# EAGLE design with 168 (EAGLE 5.07)
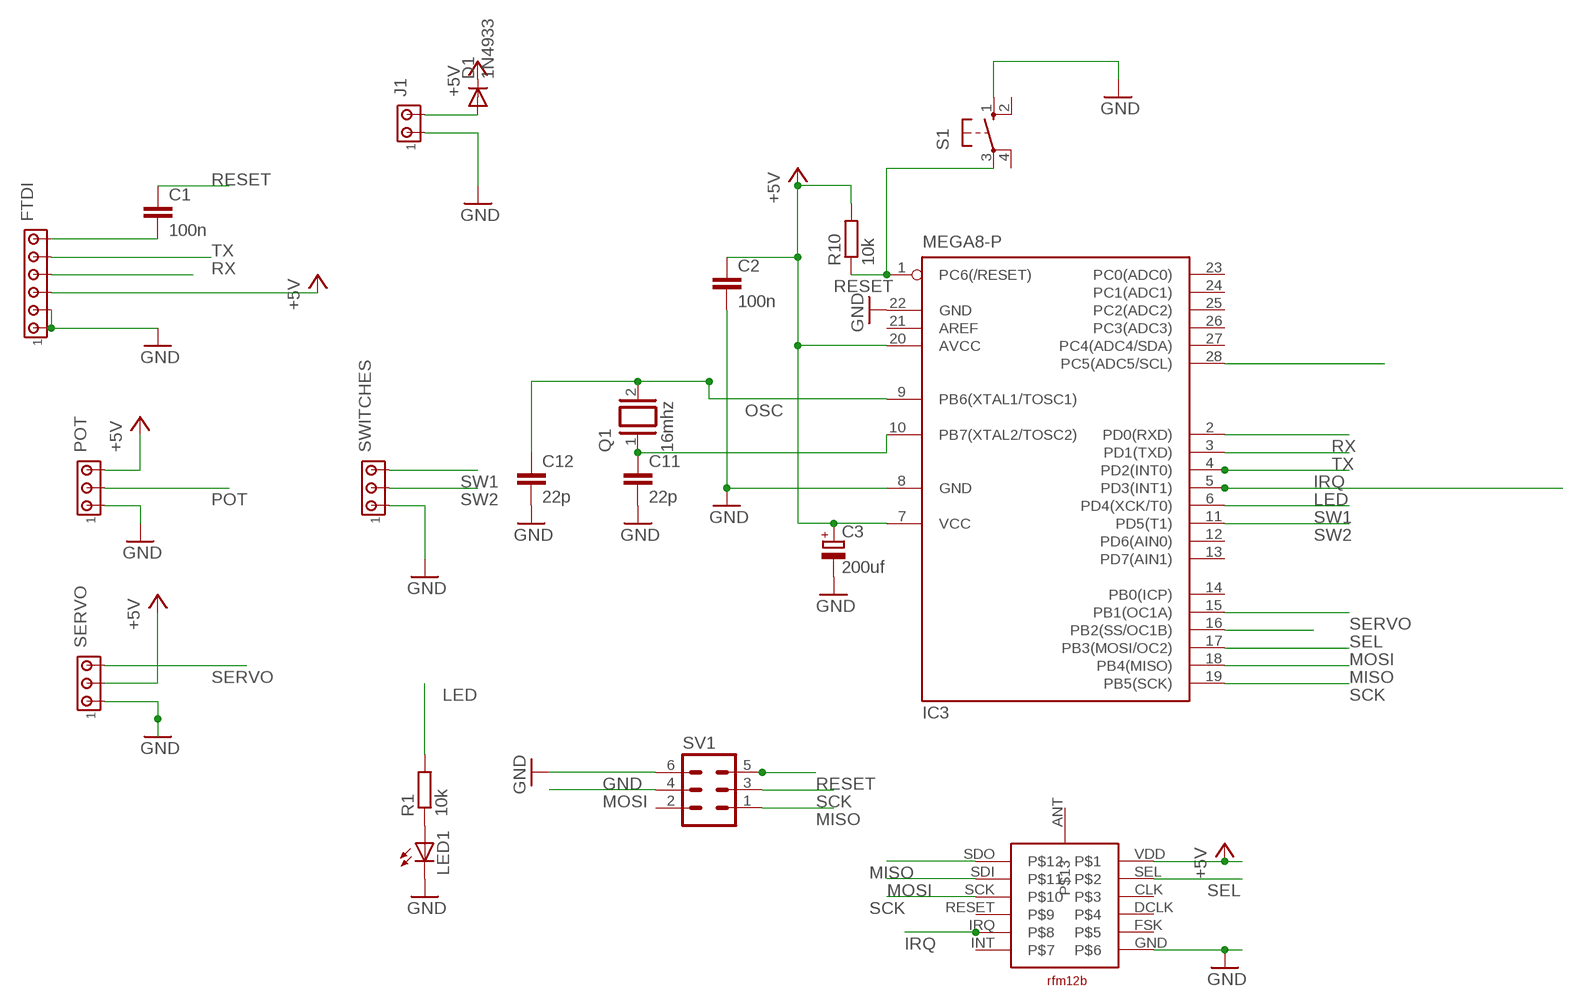
[diagram p0: schematic, sheet 1]

## Parts
C1  100n  C-EU050-025X075  [C050-025X075]
C2  100n  C-EU050-025X075  [C050-025X075]
C3  200uf  CPOL-EUE2-4  [E2-4]
C11  22p  C-EU050-025X075  [C050-025X075]
C12  22p  C-EU050-025X075  [C050-025X075]
D1  1N4933  [DO41-10]
FTDI  MTA06-100  [10X06MTA]
IC3  MEGA8-P  [DIL28-3]
J1  MTA02-100  [10X02MTA]
LED1  LED5MM  [LED5MM]
POT  MTA03-100  [10X03MTA]
Q1  16mhz  XTAL/S  [QS]
R1  10k  R-EU_0204/7  [0204/7]
R10  10k  R-EU_0204/7  [0204/7]
S1  10-XX  [B3F-10XX]
SERVO  MTA03-100  [10X03MTA]
SV1  MA03-2  [MA03-2]
SWITCHES  MTA03-100  [10X03MTA]
U$1  RFM12B  [HOPERFM12B]

## Nets
+5V: C2.1 C3.+ D1.C FTDI.4 IC3.7(VCC) IC3.20(AVCC) POT.3 R10.2 SERVO.2 U$1.VDD
GND [power]: C2.2 C3.- C11.2 C12.2 FTDI.5 FTDI.6 IC3.8(GND) IC3.22(GND) J1.1 LED1.K(C) POT.1 S1.1(S) SERVO.1 SV1.6 SWITCHES.1 U$1.GND
IRQ: IC3.4(PD2(INT0)) U$1.IRQ
LED: IC3.5(PD3(INT1)) R1.2
MISO: IC3.18(PB4(MISO)) SV1.1 U$1.SDO
MOSI: IC3.17(PB3(MOSI/OC2)) SV1.4 U$1.SDI
N$1: LED1.A R1.1
N$4: D1.A J1.2
N$5: C1.2 FTDI.1
N$10: C11.1 IC3.10(PB7(XTAL2/TOSC2)) Q1.1
OSC: C12.1 IC3.9(PB6(XTAL1/TOSC1)) Q1.2
POT: IC3.28(PC5(ADC5/SCL)) POT.2
RESET: C1.1 IC3.1(PC6(/RESET)) R10.1 S1.3(P) SV1.5
RX: FTDI.3 IC3.2(PD0(RXD))
SCK: IC3.19(PB5(SCK)) SV1.3 U$1.SCK
SEL: IC3.16(PB2(SS/OC1B)) U$1.SEL
SERVO: IC3.15(PB1(OC1A)) SERVO.3
SW1: IC3.6(PD4(XCK/T0)) SWITCHES.3
SW2: IC3.11(PD5(T1)) SWITCHES.2
TX: FTDI.2 IC3.3(PD1(TXD))
Unconnected: IC3.12(PD6(AIN0)) IC3.13(PD7(AIN1)) IC3.14(PB0(ICP)) IC3.21(AREF) IC3.23(PC0(ADC0)) IC3.24(PC1(ADC1)) IC3.25(PC2(ADC2)) IC3.26(PC3(ADC3)) IC3.27(PC4(ADC4/SDA)) S1.2(S1) S1.4(P1) SV1.2 U$1.ANT U$1.CLK U$1.DCLK U$1.FSK U$1.INT U$1.RESET

## Library data of the parts
C1 C2 C11 C12 = matt rcl:C-EU: CAPACITOR, European symbol
C3 = matt rcl:CPOL-EU: POLARIZED CAPACITOR, European symbol
D1 = matt diode:1N4933: DIODE fast recovery rectifier, 1A
FTDI = matt con-amp:MTA06-100: AMP connector
IC3 = atmel:MEGA8-P: MICROCONTROLLER 8 Kbytes FLASH, 1 kbytes SRAM, 512 bytes EEPROM, USART, 4-channel 10 bit ADC, 2-channel 8 bit ADC Pin compatible with Atmega48, ATMega88, ATMega168 Source: avr.lbr
J1 = matt con-amp:MTA02-100: AMP connector
LED1 = matt led:LED: LED OSRAM: - CHIPLED LG R971, LG N971, LY N971, LG Q971, LY Q971, LO R971, LY R971 LH N974, LH R974 LS Q976, LO Q976, LY Q976 LO Q996 - Hyper CHIPLED LW Q18S LB Q993, LB Q99A, LB R99A - SideLED LS A670, LO A670, LY A670, LG A670, LP A670 LB A673, LV A673, LT A673, LW A673 LH A674 LY A675 LS A676, LA A676, LO A676, LY A676, LW A676 LS A679, LY A679, LG A679 - Hyper Micro SIDELED® LS Y876, LA Y876, LO Y876, LY Y876 LT Y87S - SmartLED LW L88C, LW L88S LB L89C, LB L89S, LG L890 LS L89K, LO L89K, LY L89K LS L896, LA L896, LO L896, LY L896 - TOPLED LS T670, LO T670, LY T670, LG T670, LP T670 LSG T670, LSP T670, LSY T670, LOP T670, LYG T670 LG T671, LOG T671, LSG T671 LB T673, LV T673, LT T673, LW T673 LH T674 LS T676, LA T676, LO T676, LY T676, LB T676, LH T676, LSB T676, LW T676 LB T67C, LV T67C, LT T67C, LS T67K, LO T67K, LY T67K, LW E67C LS E67B, LA E67B, LO E67B, LY E67B, LB E67C, LV E67C, LT E67C LW T67C LS T679, LY T679, LG T679 LS T770, LO T770, LY T770, LG T770, LP T770 LB T773, LV T773, LT T773, LW T773 LH T774 LS E675, LA E675, LY E675, LS T675 LS T776, LA T776, LO T776, LY T776, LB T776 LHGB T686 LT T68C, LB T68C - Hyper Mini TOPLED® LB M676 - Mini TOPLED Santana® LG M470 LS M47K, LO M47K, LY M47K Source: http://www.osram.convergy.de LUXEON: - LUMILED® LXK2-PW12-R00, LXK2-PW12-S00, LXK2-PW14-U00, LXK2-PW14-V00 LXK2-PM12-R00, LXK2-PM12-S00, LXK2-PM14-U00 LXK2-PE12-Q00, LXK2-PE12-R00, LXK2-PE12-S00, LXK2-PE14-T00, LXK2-PE14-U00 LXK2-PB12-K00, LXK2-PB12-L00, LXK2-PB12-M00, LXK2-PB14-N00, LXK2-PB14-P00, LXK2-PB14-Q00 LXK2-PR12-L00, LXK2-PR12-M00, LXK2-PR14-Q00, LXK2-PR14-R00 LXK2-PD12-Q00, LXK2-PD12-R00, LXK2-PD12-S00 LXK2-PH12-R00, LXK2-PH12-S00 LXK2-PL12-P00, LXK2-PL12-Q00, LXK2-PL12-R00 Source: www.luxeon.com KINGBRIGHT: KA-3528ASYC Source: www.kingbright.com
POT SERVO SWITCHES = matt con-amp:MTA03-100: AMP connector
Q1 = matt special:XTAL/S: CRYSTAL
R1 R10 = matt rcl:R-EU_: RESISTOR, European symbol
S1 = switch-omron:10-XX: OMRON SWITCH
SV1 = con-lstb:MA03-2: PIN HEADER
U$1 = matt:RFM12B

## Net classes
1 power: width 1 mm

## Board
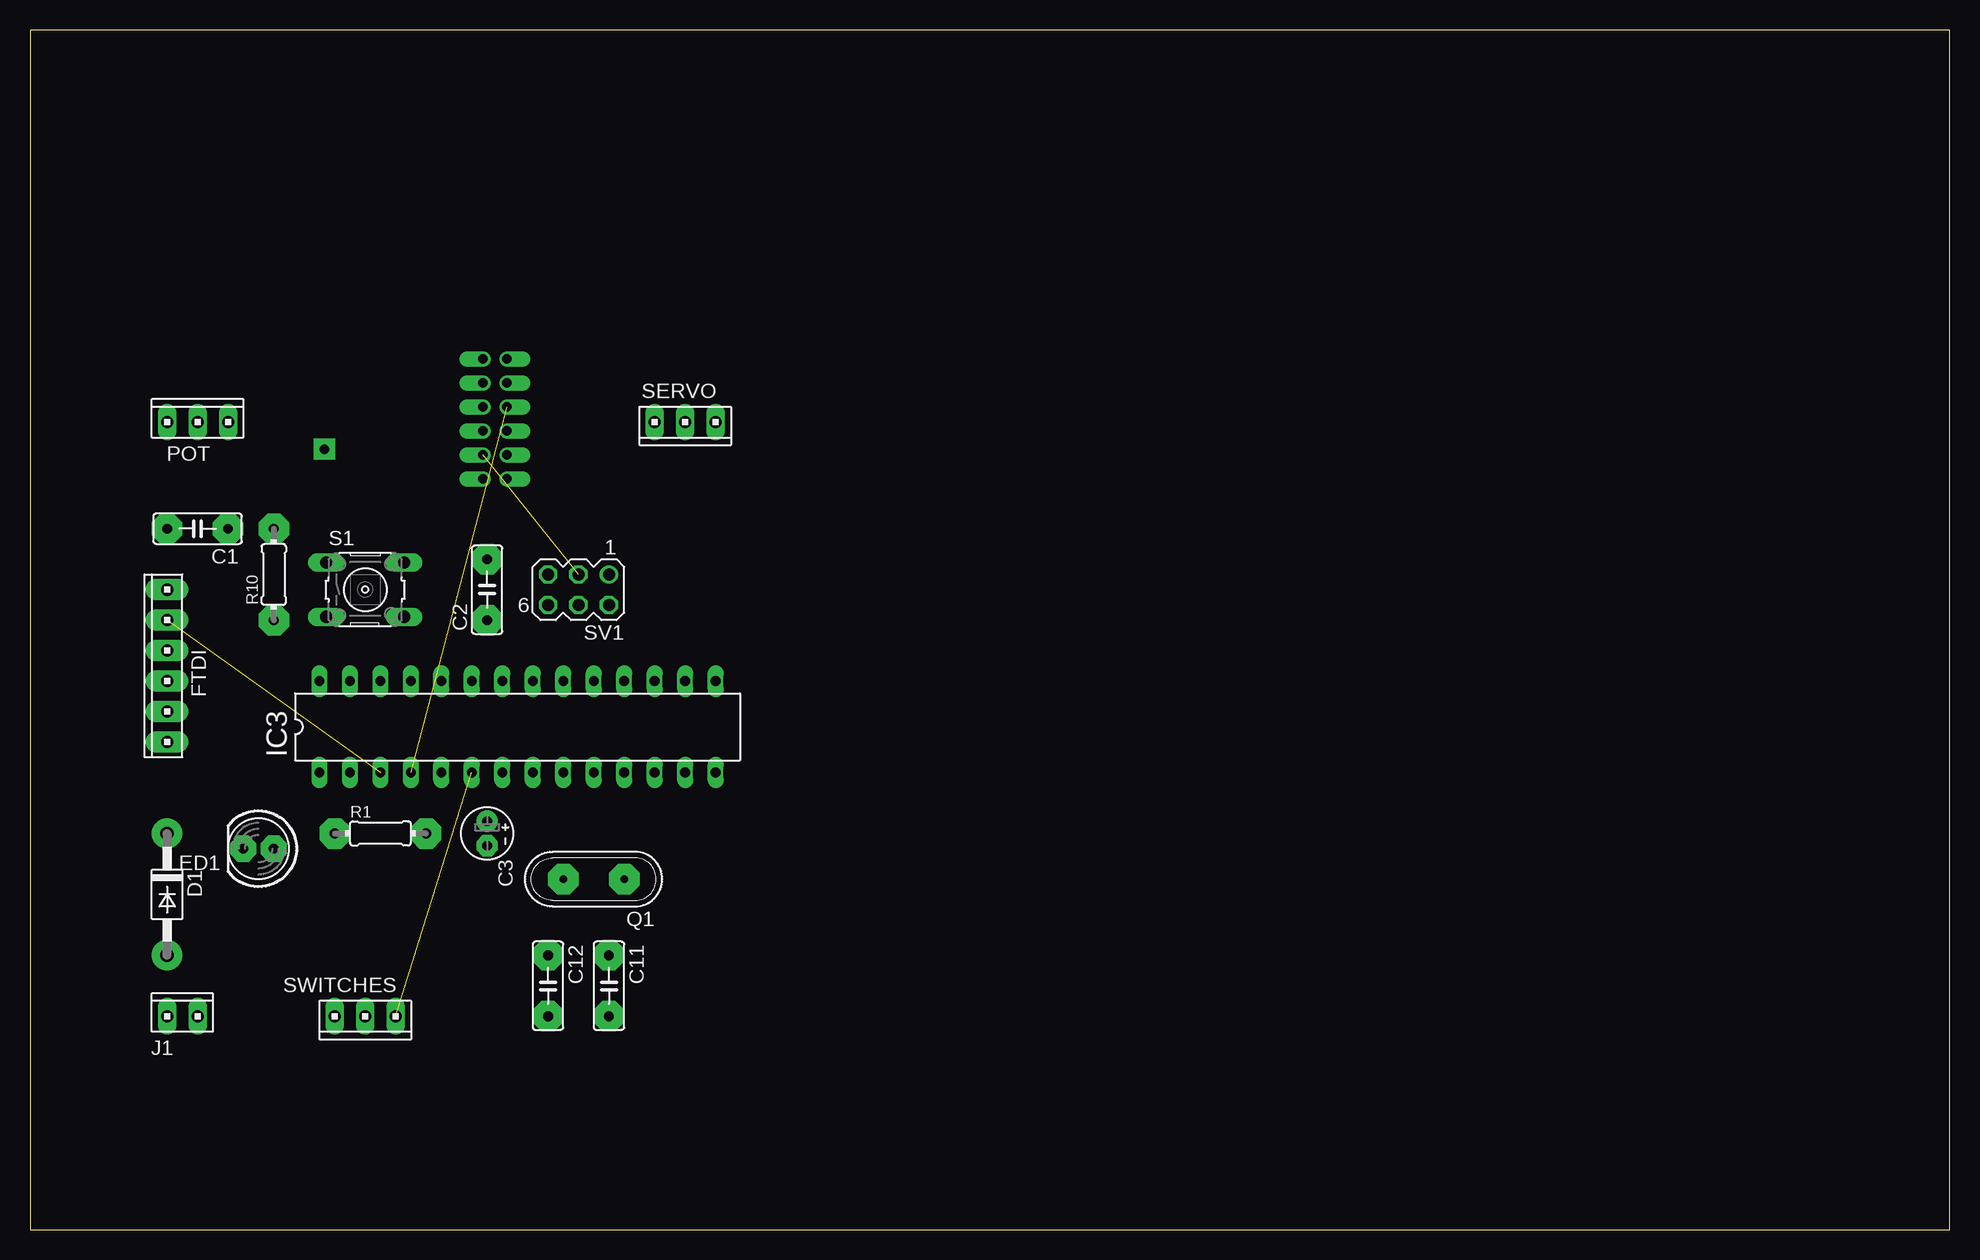
[diagram p1: board, top side]
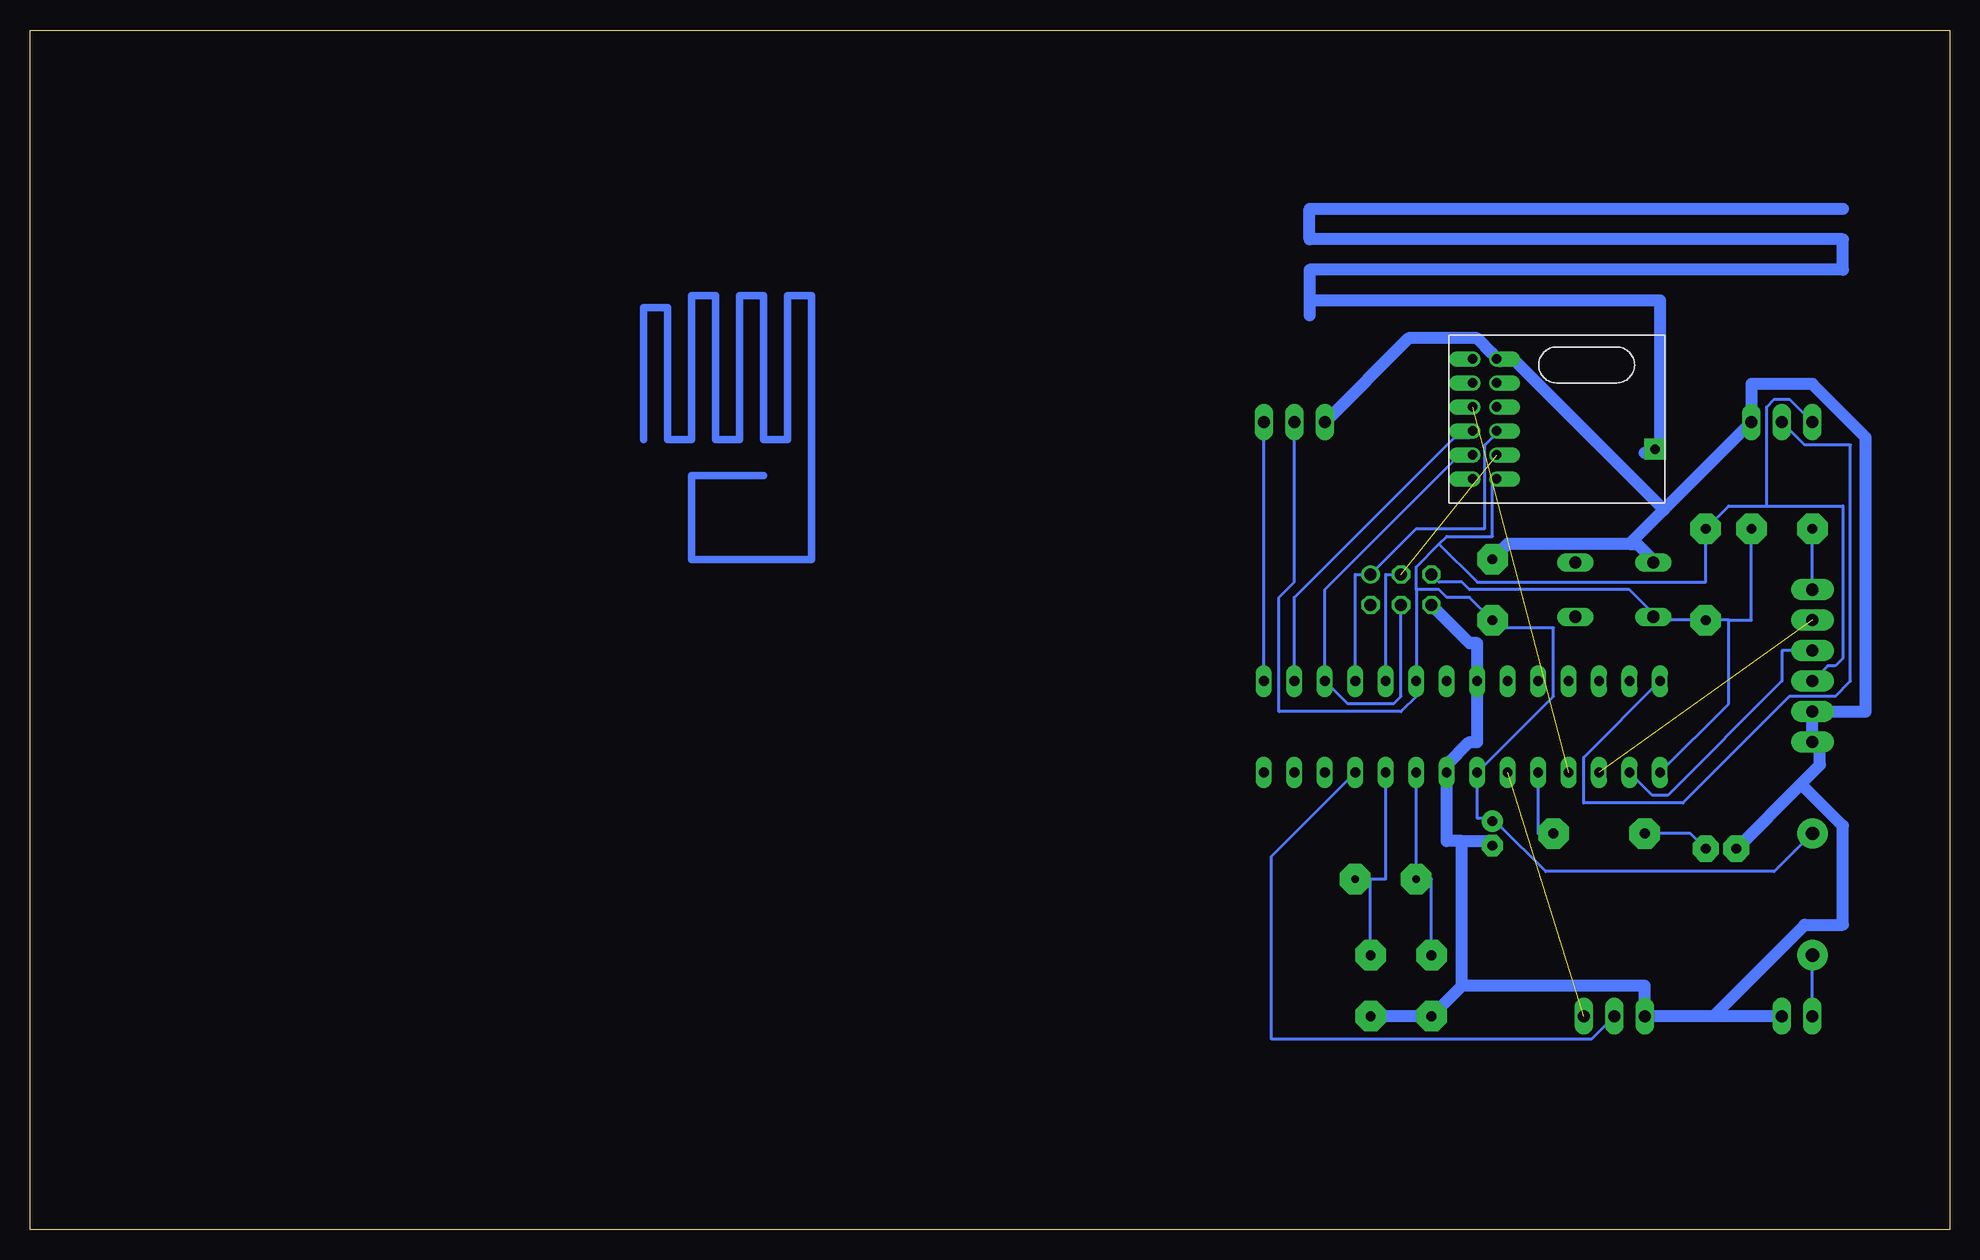
[diagram p2: board, bottom side, seen from below]

Size 160 x 100 mm. Coordinates in mm from the lower left corner, seen from the top.
Outline: 0,0 160,0 160,100 0,100 0,0
Copper layers (1*16): Top 0.035mm / dielectric 1.5mm / Bottom 0.035mm
Design rules "default": minimum track width 10mil, minimum drill 24mil, track to track 8mil, track to pad 8mil, pad to pad 8mil, via to via 8mil, smd to smd 8mil, copper to edge 40mil, drill to drill 8mil, minimum pad ring 10mil, minimum via ring 8mil, stop-mask expansion 4mil, vias tented up to drill 0mil, thermal gap 10mil

### Footprints (pad centres in the part's own frame; a part is rotated, then mirrored left to right if it is on the bottom)
C050-025X075 = drill 0.813 pad 2.54 octagon: 1 -2.54,0; 2 2.54,0
E2-4 = drill 0.813 pad 1.778 round: + -1.016,0 | drill 0.813 pad 1.778 octagon: - 1.016,0
DO41-10 = drill 1.118 pad 2.54 round: A 5.08,0; C -5.08,0
10X06MTA = drill 1.016 pad 1.778 long: 1 6.35,0; 2 3.81,0; 3 1.27,0; 4 -1.27,0; 5 -3.81,0; 6 -6.35,0
DIL28-3 = drill 0.813 long: 1 -16.51,-3.81; 2 -13.97,-3.81; 3 -11.43,-3.81; 4 -8.89,-3.81; 5 -6.35,-3.81; 6 -3.81,-3.81; 7 -1.27,-3.81; 8 1.27,-3.81; 9 3.81,-3.81; 10 6.35,-3.81; 11 8.89,-3.81; 12 11.43,-3.81; 13 13.97,-3.81; 14 16.51,-3.81; 15 16.51,3.81; 16 13.97,3.81; 17 11.43,3.81; 18 8.89,3.81; 19 6.35,3.81; 20 3.81,3.81; 21 1.27,3.81; 22 -1.27,3.81; 23 -3.81,3.81; 24 -6.35,3.81; 25 -8.89,3.81; 26 -11.43,3.81; 27 -13.97,3.81; 28 -16.51,3.81
10X02MTA = drill 1.016 long: 1 1.27,0; 2 -1.27,0
LED5MM = drill 0.813 pad 2.184 octagon: A -1.27,0; K 1.27,0
10X03MTA = drill 1.016 long: 1 2.54,0; 2 0,0; 3 -2.54,0
QS = drill 0.61 pad 2.54 octagon: 1 -2.54,0; 2 2.54,0
0204/7 = drill 0.813 pad 2.54 octagon: 1 -3.81,0; 2 3.81,0
B3F-10XX = drill 1.016 long: 1 -3.251,2.261; 2 3.251,2.261; 3 -3.251,-2.261; 4 3.251,-2.261
MA03-2 = drill 1.016 round: 1 -2.54,-1.27 | drill 1.016 octagon: 2 -2.54,1.27; 3 0,-1.27; 4 0,1.27; 5 2.54,-1.27; 6 2.54,1.27
HOPERFM12B = drill 0.8 pad 1.778 square: ANT -8.473,-2.254 | drill 0.8 offset: CLK 4.73,3.27; DCLK 6.73,3.27; FSK 4.73,1.27; GND 4.73,5.27; INT 6.73,-4.73; IRQ 6.73,1.27; RESET 6.73,5.27; SCK 4.73,-2.73; SDI 6.73,-2.73; SDO 4.73,-0.73; SEL 6.73,-0.73; VDD 4.73,-4.73

### Placement (x,y rotation side)
C1  13.97,58.42 180 top
C2  38.1,53.34 90 top
C3  38.1,33.02 270 top
C11  48.26,20.32 270 top
C12  43.18,20.32 270 top
D1  11.43,27.94 270 top
FTDI  11.43,46.99 90 top
IC3  40.64,41.91 0 top
J1  12.7,17.78 0 top
LED1  19.05,31.75 180 top
POT  13.97,67.31 0 top
Q1  46.99,29.21 180 top
R1  29.21,33.02 0 top
R10  20.32,54.61 90 top
S1  27.94,53.34 0 top
SERVO  54.61,67.31 180 top
SV1  45.72,53.34 180 top
SWITCHES  27.94,17.78 180 top
U$1  33.02,67.31 0 top

### Tracks (layer width: path | path; a pad name or v marks a point on that pad's centre or on a via)
+5V
  Bottom 0.254: D1.C 14.61,29.84 33.66,29.84 37.47,33.66 38.1,33.66 C3.+ 38.1,34.29 39.37,34.29 IC3.7 33.02,44.45 33.02,50.16 37.47,50.16 C2.1 40.01,52.7 41.91,52.7 42.55,53.34 44.45,53.34 | POT.3 13.34,69.22 14.61,69.22 15.24,68.58 15.24,60.33 | 15.24,60.33 18.41,60.33 R10.2 20.32,53.98 39.37,53.98 42.55,57.15 | FTDI.4 10.16,46.99 9.53,46.99 8.89,47.62 8.89,60.33 15.24,60.33 | 42.55,57.15 44.45,55.24 44.45,53.34 | 42.55,57.15 41.91,57.78 38.1,57.78 38.1,62.23 U$1.VDD | 44.45,53.34 IC3.20 44.45,44.45 45.72,43.18 55.88,43.18 55.88,52.7 54.61,53.98 SERVO.2
GND
  Bottom 1: SERVO.1 45.09,74.3 39.37,74.3 38.1,73.03 U$1.GND 37.47,72.39 36.2,72.39 23.81,60.01 | 26.67,57.15 36.83,57.15 C2.2 | 26.67,57.15 26.04,57.15 24.77,55.88 S1.1 | 23.81,60.01 26.67,57.15 | 23.81,60.01 POT.1 16.51,70.48 11.43,70.48 6.99,66.04 6.99,43.18 FTDI.5 FTDI.6 10.79,40.64 10.79,38.73 12.38,37.15 | 12.38,37.15 LED1.K | 19.68,17.78 SWITCHES.1 25.4,20.32 40.64,20.32 | J1.1 19.68,17.78 | C11.2 C12.2 40.64,20.32 | SV1.6 40.01,48.9 39.37,48.9 IC3.22 39.37,40.64 40.01,40.64 41.91,38.73 IC3.8 41.91,32.38 40.64,32.38 | 40.64,32.38 38.1,32.38 C3.- | 40.64,20.32 40.64,32.38 | 19.68,17.78 12.06,25.4 8.89,25.4 8.89,33.66 12.38,37.15
IRQ  (1 unrouted)
LED
  Bottom 0.254: IC3.5 34.29,33.02 R1.2
MISO
  Bottom 0.254: U$1.SDO 38.1,66.04 38.73,65.41 38.73,58.42 44.45,58.42 SV1.1 49.53,54.61 IC3.18
MOSI
  Bottom 0.254: U$1.SDI 40.01,64.14 41.27,64.14 52.07,53.34 IC3.17 50.16,43.81 46.35,43.81 45.72,44.45 SV1.4
N$1
  Bottom 0.254: LED1.A 21.59,33.02 R1.1
N$2
  Bottom 0.61: 98.87,62.85 104.87,62.85 104.87,55.85 94.87,55.85 94.87,77.85 96.87,77.85 96.87,65.85 98.87,65.85 98.87,77.85 100.87,77.85 100.87,65.85 102.87,65.85 102.87,77.85 104.87,77.85 104.87,65.85 106.87,65.85 106.87,76.85 108.87,76.85 108.87,65.85
N$3
  Bottom 1.016: 25.4,64.77 24.13,64.77 24.13,77.47 53.34,77.47 | 53.34,77.47 53.34,76.2 | 53.34,77.47 53.34,80.01 8.89,80.01 8.89,82.55 53.34,82.55 53.34,85.09 8.89,85.09
N$4
  Bottom 0.254: J1.2 D1.A
N$5
  Bottom 0.254: FTDI.1 C1.2
N$10
  Bottom 0.254: IC3.10 46.99,29.21 48.26,29.21 | 48.26,29.21 Q1.1 | C11.1 48.26,29.21
OSC
  Bottom 0.254: IC3.9 Q1.2 43.18,29.21 C12.1
POT
  Bottom 0.254: IC3.28 30.48,39.37 30.48,35.56 22.23,35.56 13.34,44.45 9.53,44.45 8.26,45.72 8.26,65.41 12.06,65.41 POT.2
RESET
  Bottom 0.254: IC3.1 18.41,43.81 18.41,50.8 | 18.41,50.8 R10.1 24.13,50.8 S1.3 24.77,51.44 26.67,53.34 40.01,53.34 40.64,53.98 42.55,53.98 SV1.5 | C1.1 16.51,50.8 18.41,50.8
RX
  Bottom 0.254: IC3.2 24.77,36.2 23.5,36.2 13.97,45.72 13.97,48.26 FTDI.3
SCK  (1 unrouted)
  Bottom 0.254: IC3.19 46.99,54.61 SV1.3
SEL
  Bottom 0.254: IC3.16 54.61,52.7 41.27,66.04 40.01,66.04 U$1.SEL
SERVO
  Bottom 0.254: IC3.15 SERVO.3
SW1  (1 unrouted)
SW2
  Bottom 0.254: IC3.11 56.52,31.11 56.52,15.88 29.84,15.88 SWITCHES.2
TX  (1 unrouted)